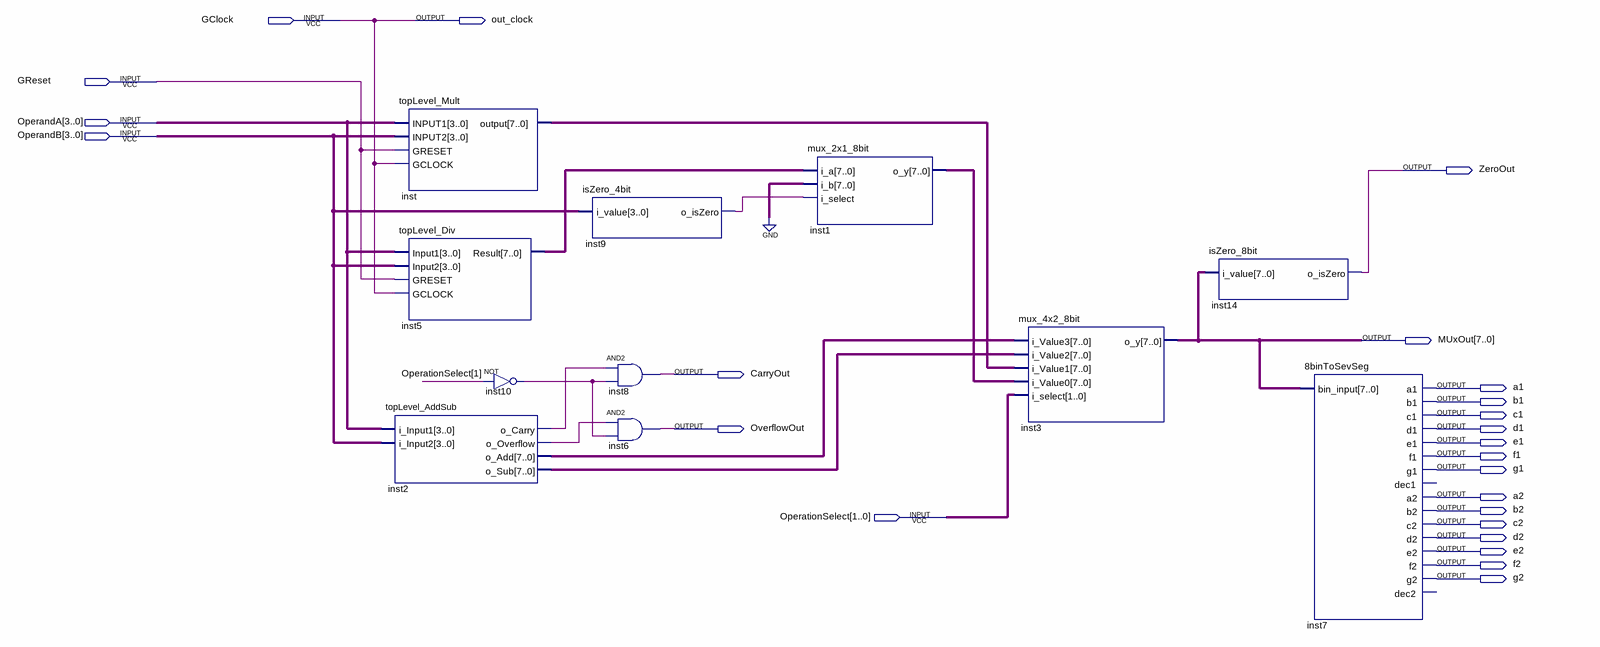
[diagram p0: schematic sheet]
// Quartus schematic topLevel.bdf as structural Verilog: 11 symbols, 24 pins
module topLevel (
  input  GClock,
  input  GReset,
  input  [3:0] OperandA,
  input  [3:0] OperandB,
  input  [1:0] OperationSelect,
  output out_clock,
  output ZeroOut,
  output [7:0] MUxOut,
  output CarryOut,
  output a1,
  output b1,
  output c1,
  output OverflowOut,
  output d1,
  output e1,
  output f1,
  output g1,
  output a2,
  output b2,
  output c2,
  output d2,
  output e2,
  output f2,
  output g2
);

  wire inst2_o_carry, inst2_o_overflow, inst9_o_iszero, inst10_out;
  wire [7:0] inst1_o_y, inst2_o_add, inst2_o_sub, inst5_result, inst_output;

  topLevel_AddSub inst2 (
    .i_Input1(OperandA), .i_Input2(OperandB), .o_Carry(inst2_o_carry), .o_Overflow(inst2_o_overflow),
    .o_Add(inst2_o_add), .o_Sub(inst2_o_sub));
  topLevel_Mult inst (.INPUT1(OperandA), .INPUT2(OperandB), .GRESET(GReset), .GCLOCK(GClock), .\output (inst_output));
  topLevel_Div inst5 (.Input1(OperandA), .Input2(OperandB), .GRESET(GReset), .GCLOCK(GClock), .Result(inst5_result));
  not inst10 (inst10_out, OperationSelect[1]);
  isZero_4bit inst9 (.i_value(OperandB), .o_isZero(inst9_o_iszero));
  and inst8 (CarryOut, inst2_o_carry, inst10_out);
  and inst6 (OverflowOut, inst2_o_overflow, inst10_out);
  mux_2x1_8bit inst1 (.i_a(inst5_result), .i_b({8{1'b0}}), .i_select(inst9_o_iszero), .o_y(inst1_o_y));
  mux_4x2_8bit inst3 (
    .i_Value3(inst2_o_add), .i_Value2(inst2_o_sub), .i_Value1(inst_output), .i_Value0(inst1_o_y),
    .i_select(OperationSelect), .o_y(MUxOut));
  isZero_8bit inst14 (.i_value(MUxOut), .o_isZero(ZeroOut));
  \8binToSevSeg  inst7 (
    .bin_input(MUxOut), .a1(a1), .b1(b1), .c1(c1), .d1(d1), .e1(e1), .f1(f1), .g1(g1), .a2(a2), .b2(b2),
    .c2(c2), .d2(d2), .e2(e2), .f2(f2), .g2(g2));  // open: dec1, dec2

  assign out_clock = GClock;
endmodule
